# Vivado block design bd_8ee2, xc7z020clg400-1, Vivado 2019.1
# (continued, part 4 of 5)
current_bd_instance /s15_nodes

# ---- hierarchy /m00_nodes ----
current_bd_instance /m00_nodes
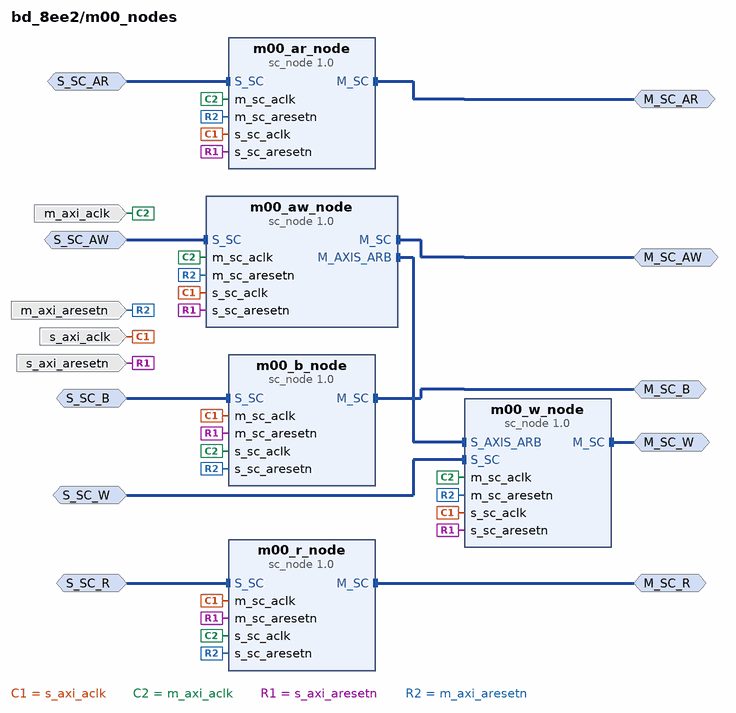
[diagram p35: block diagram inside /m00_nodes]
create_bd_intf_pin -mode Master -vlnv xilinx.com:interface:sc_rtl:1.0 M_SC_AR
create_bd_intf_pin -mode Slave -vlnv xilinx.com:interface:sc_rtl:1.0 S_SC_AR
create_bd_intf_pin -mode Master -vlnv xilinx.com:interface:sc_rtl:1.0 M_SC_R
create_bd_intf_pin -mode Slave -vlnv xilinx.com:interface:sc_rtl:1.0 S_SC_R
create_bd_intf_pin -mode Master -vlnv xilinx.com:interface:sc_rtl:1.0 M_SC_AW
create_bd_intf_pin -mode Slave -vlnv xilinx.com:interface:sc_rtl:1.0 S_SC_AW
create_bd_intf_pin -mode Master -vlnv xilinx.com:interface:sc_rtl:1.0 M_SC_W
create_bd_intf_pin -mode Slave -vlnv xilinx.com:interface:sc_rtl:1.0 S_SC_W
create_bd_intf_pin -mode Master -vlnv xilinx.com:interface:sc_rtl:1.0 M_SC_B
create_bd_intf_pin -mode Slave -vlnv xilinx.com:interface:sc_rtl:1.0 S_SC_B
create_bd_pin -dir I -type clk s_axi_aclk
create_bd_pin -dir I -type rst s_axi_aresetn
create_bd_pin -dir I -type clk m_axi_aclk
create_bd_pin -dir I -type rst m_axi_aresetn

create_bd_cell -type ip -vlnv xilinx.com:ip:sc_node:1.0 m00_ar_node
set_property -dict [list \
  CONFIG.ACLK_RELATIONSHIP 1 \
  CONFIG.ADDR_WIDTH 32 \
  CONFIG.CHANNEL 2 \
  CONFIG.ID_WIDTH 5 \
  CONFIG.M00_NUM_BYTES 8 \
  CONFIG.M01_NUM_BYTES 8 \
  CONFIG.M02_NUM_BYTES 8 \
  CONFIG.M03_NUM_BYTES 8 \
  CONFIG.M04_NUM_BYTES 8 \
  CONFIG.M05_NUM_BYTES 8 \
  CONFIG.M06_NUM_BYTES 8 \
  CONFIG.M07_NUM_BYTES 8 \
  CONFIG.M08_NUM_BYTES 8 \
  CONFIG.M09_NUM_BYTES 8 \
  CONFIG.M10_NUM_BYTES 8 \
  CONFIG.M11_NUM_BYTES 8 \
  CONFIG.M12_NUM_BYTES 8 \
  CONFIG.M13_NUM_BYTES 8 \
  CONFIG.M14_NUM_BYTES 8 \
  CONFIG.M15_NUM_BYTES 8 \
  CONFIG.MAX_PAYLD_BYTES 8 \
  CONFIG.M_SEND_PIPELINE 0 \
  CONFIG.NUM_MI 1 \
  CONFIG.NUM_OUTSTANDING 16 \
  CONFIG.NUM_SI 16 \
  CONFIG.PAYLD_WIDTH 146 \
  CONFIG.S00_NUM_BYTES 8 \
  CONFIG.S01_NUM_BYTES 8 \
  CONFIG.S02_NUM_BYTES 8 \
  CONFIG.S03_NUM_BYTES 8 \
  CONFIG.S04_NUM_BYTES 8 \
  CONFIG.S05_NUM_BYTES 8 \
  CONFIG.S06_NUM_BYTES 8 \
  CONFIG.S07_NUM_BYTES 8 \
  CONFIG.S08_NUM_BYTES 8 \
  CONFIG.S09_NUM_BYTES 8 \
  CONFIG.S10_NUM_BYTES 8 \
  CONFIG.S11_NUM_BYTES 8 \
  CONFIG.S12_NUM_BYTES 8 \
  CONFIG.S13_NUM_BYTES 8 \
  CONFIG.S14_NUM_BYTES 8 \
  CONFIG.S15_NUM_BYTES 8 \
  CONFIG.SC_ROUTE_WIDTH 1 \
  CONFIG.S_LATENCY 1 \
  CONFIG.USER_WIDTH 0 \
] [get_bd_cells m00_ar_node]
create_bd_cell -type ip -vlnv xilinx.com:ip:sc_node:1.0 m00_r_node
set_property -dict [list \
  CONFIG.ACLK_RELATIONSHIP 1 \
  CONFIG.ADDR_WIDTH 32 \
  CONFIG.CHANNEL 0 \
  CONFIG.ID_WIDTH 5 \
  CONFIG.M00_NUM_BYTES 8 \
  CONFIG.M01_NUM_BYTES 8 \
  CONFIG.M02_NUM_BYTES 8 \
  CONFIG.M03_NUM_BYTES 8 \
  CONFIG.M04_NUM_BYTES 8 \
  CONFIG.M05_NUM_BYTES 8 \
  CONFIG.M06_NUM_BYTES 8 \
  CONFIG.M07_NUM_BYTES 8 \
  CONFIG.M08_NUM_BYTES 8 \
  CONFIG.M09_NUM_BYTES 8 \
  CONFIG.M10_NUM_BYTES 8 \
  CONFIG.M11_NUM_BYTES 8 \
  CONFIG.M12_NUM_BYTES 8 \
  CONFIG.M13_NUM_BYTES 8 \
  CONFIG.M14_NUM_BYTES 8 \
  CONFIG.M15_NUM_BYTES 8 \
  CONFIG.MAX_PAYLD_BYTES 8 \
  CONFIG.M_PIPELINE 0 \
  CONFIG.NUM_MI 16 \
  CONFIG.NUM_OUTSTANDING 16 \
  CONFIG.NUM_SI 1 \
  CONFIG.PAYLD_WIDTH 102 \
  CONFIG.S00_NUM_BYTES 8 \
  CONFIG.S01_NUM_BYTES 8 \
  CONFIG.S02_NUM_BYTES 8 \
  CONFIG.S03_NUM_BYTES 8 \
  CONFIG.S04_NUM_BYTES 8 \
  CONFIG.S05_NUM_BYTES 8 \
  CONFIG.S06_NUM_BYTES 8 \
  CONFIG.S07_NUM_BYTES 8 \
  CONFIG.S08_NUM_BYTES 8 \
  CONFIG.S09_NUM_BYTES 8 \
  CONFIG.S10_NUM_BYTES 8 \
  CONFIG.S11_NUM_BYTES 8 \
  CONFIG.S12_NUM_BYTES 8 \
  CONFIG.S13_NUM_BYTES 8 \
  CONFIG.S14_NUM_BYTES 8 \
  CONFIG.S15_NUM_BYTES 8 \
  CONFIG.SC_ROUTE_WIDTH 16 \
  CONFIG.USER_BITS_PER_BYTE 0 \
  CONFIG.USER_WIDTH 0 \
] [get_bd_cells m00_r_node]
create_bd_cell -type ip -vlnv xilinx.com:ip:sc_node:1.0 m00_aw_node
set_property -dict [list \
  CONFIG.ACLK_RELATIONSHIP 1 \
  CONFIG.ADDR_WIDTH 32 \
  CONFIG.CHANNEL 3 \
  CONFIG.ID_WIDTH 5 \
  CONFIG.M00_NUM_BYTES 8 \
  CONFIG.M01_NUM_BYTES 8 \
  CONFIG.M02_NUM_BYTES 8 \
  CONFIG.M03_NUM_BYTES 8 \
  CONFIG.M04_NUM_BYTES 8 \
  CONFIG.M05_NUM_BYTES 8 \
  CONFIG.M06_NUM_BYTES 8 \
  CONFIG.M07_NUM_BYTES 8 \
  CONFIG.M08_NUM_BYTES 8 \
  CONFIG.M09_NUM_BYTES 8 \
  CONFIG.M10_NUM_BYTES 8 \
  CONFIG.M11_NUM_BYTES 8 \
  CONFIG.M12_NUM_BYTES 8 \
  CONFIG.M13_NUM_BYTES 8 \
  CONFIG.M14_NUM_BYTES 8 \
  CONFIG.M15_NUM_BYTES 8 \
  CONFIG.MAX_PAYLD_BYTES 8 \
  CONFIG.M_SEND_PIPELINE 0 \
  CONFIG.NUM_MI 1 \
  CONFIG.NUM_OUTSTANDING 16 \
  CONFIG.NUM_SI 16 \
  CONFIG.PAYLD_WIDTH 146 \
  CONFIG.S00_NUM_BYTES 8 \
  CONFIG.S01_NUM_BYTES 8 \
  CONFIG.S02_NUM_BYTES 8 \
  CONFIG.S03_NUM_BYTES 8 \
  CONFIG.S04_NUM_BYTES 8 \
  CONFIG.S05_NUM_BYTES 8 \
  CONFIG.S06_NUM_BYTES 8 \
  CONFIG.S07_NUM_BYTES 8 \
  CONFIG.S08_NUM_BYTES 8 \
  CONFIG.S09_NUM_BYTES 8 \
  CONFIG.S10_NUM_BYTES 8 \
  CONFIG.S11_NUM_BYTES 8 \
  CONFIG.S12_NUM_BYTES 8 \
  CONFIG.S13_NUM_BYTES 8 \
  CONFIG.S14_NUM_BYTES 8 \
  CONFIG.S15_NUM_BYTES 8 \
  CONFIG.SC_ROUTE_WIDTH 1 \
  CONFIG.S_LATENCY 1 \
  CONFIG.USER_WIDTH 0 \
] [get_bd_cells m00_aw_node]
create_bd_cell -type ip -vlnv xilinx.com:ip:sc_node:1.0 m00_w_node
set_property -dict [list \
  CONFIG.ACLK_RELATIONSHIP 1 \
  CONFIG.ADDR_WIDTH 32 \
  CONFIG.CHANNEL 1 \
  CONFIG.ID_WIDTH 5 \
  CONFIG.M00_NUM_BYTES 8 \
  CONFIG.M01_NUM_BYTES 8 \
  CONFIG.M02_NUM_BYTES 8 \
  CONFIG.M03_NUM_BYTES 8 \
  CONFIG.M04_NUM_BYTES 8 \
  CONFIG.M05_NUM_BYTES 8 \
  CONFIG.M06_NUM_BYTES 8 \
  CONFIG.M07_NUM_BYTES 8 \
  CONFIG.M08_NUM_BYTES 8 \
  CONFIG.M09_NUM_BYTES 8 \
  CONFIG.M10_NUM_BYTES 8 \
  CONFIG.M11_NUM_BYTES 8 \
  CONFIG.M12_NUM_BYTES 8 \
  CONFIG.M13_NUM_BYTES 8 \
  CONFIG.M14_NUM_BYTES 8 \
  CONFIG.M15_NUM_BYTES 8 \
  CONFIG.MAX_PAYLD_BYTES 8 \
  CONFIG.M_SEND_PIPELINE 0 \
  CONFIG.NUM_MI 1 \
  CONFIG.NUM_OUTSTANDING 16 \
  CONFIG.NUM_SI 16 \
  CONFIG.PAYLD_WIDTH 88 \
  CONFIG.S00_NUM_BYTES 8 \
  CONFIG.S01_NUM_BYTES 8 \
  CONFIG.S02_NUM_BYTES 8 \
  CONFIG.S03_NUM_BYTES 8 \
  CONFIG.S04_NUM_BYTES 8 \
  CONFIG.S05_NUM_BYTES 8 \
  CONFIG.S06_NUM_BYTES 8 \
  CONFIG.S07_NUM_BYTES 8 \
  CONFIG.S08_NUM_BYTES 8 \
  CONFIG.S09_NUM_BYTES 8 \
  CONFIG.S10_NUM_BYTES 8 \
  CONFIG.S11_NUM_BYTES 8 \
  CONFIG.S12_NUM_BYTES 8 \
  CONFIG.S13_NUM_BYTES 8 \
  CONFIG.S14_NUM_BYTES 8 \
  CONFIG.S15_NUM_BYTES 8 \
  CONFIG.SC_ROUTE_WIDTH 1 \
  CONFIG.S_LATENCY 1 \
  CONFIG.USER_BITS_PER_BYTE 0 \
  CONFIG.USER_WIDTH 0 \
] [get_bd_cells m00_w_node]
create_bd_cell -type ip -vlnv xilinx.com:ip:sc_node:1.0 m00_b_node
set_property -dict [list \
  CONFIG.ACLK_RELATIONSHIP 1 \
  CONFIG.ADDR_WIDTH 32 \
  CONFIG.CHANNEL 4 \
  CONFIG.ID_WIDTH 5 \
  CONFIG.M00_NUM_BYTES 8 \
  CONFIG.M01_NUM_BYTES 8 \
  CONFIG.M02_NUM_BYTES 8 \
  CONFIG.M03_NUM_BYTES 8 \
  CONFIG.M04_NUM_BYTES 8 \
  CONFIG.M05_NUM_BYTES 8 \
  CONFIG.M06_NUM_BYTES 8 \
  CONFIG.M07_NUM_BYTES 8 \
  CONFIG.M08_NUM_BYTES 8 \
  CONFIG.M09_NUM_BYTES 8 \
  CONFIG.M10_NUM_BYTES 8 \
  CONFIG.M11_NUM_BYTES 8 \
  CONFIG.M12_NUM_BYTES 8 \
  CONFIG.M13_NUM_BYTES 8 \
  CONFIG.M14_NUM_BYTES 8 \
  CONFIG.M15_NUM_BYTES 8 \
  CONFIG.MAX_PAYLD_BYTES 8 \
  CONFIG.M_PIPELINE 0 \
  CONFIG.NUM_MI 16 \
  CONFIG.NUM_OUTSTANDING 16 \
  CONFIG.NUM_SI 1 \
  CONFIG.PAYLD_WIDTH 24 \
  CONFIG.S00_NUM_BYTES 8 \
  CONFIG.S01_NUM_BYTES 8 \
  CONFIG.S02_NUM_BYTES 8 \
  CONFIG.S03_NUM_BYTES 8 \
  CONFIG.S04_NUM_BYTES 8 \
  CONFIG.S05_NUM_BYTES 8 \
  CONFIG.S06_NUM_BYTES 8 \
  CONFIG.S07_NUM_BYTES 8 \
  CONFIG.S08_NUM_BYTES 8 \
  CONFIG.S09_NUM_BYTES 8 \
  CONFIG.S10_NUM_BYTES 8 \
  CONFIG.S11_NUM_BYTES 8 \
  CONFIG.S12_NUM_BYTES 8 \
  CONFIG.S13_NUM_BYTES 8 \
  CONFIG.S14_NUM_BYTES 8 \
  CONFIG.S15_NUM_BYTES 8 \
  CONFIG.SC_ROUTE_WIDTH 16 \
  CONFIG.USER_WIDTH 0 \
] [get_bd_cells m00_b_node]

# ---- hierarchy /m00_exit_pipeline ----
current_bd_instance /m00_exit_pipeline
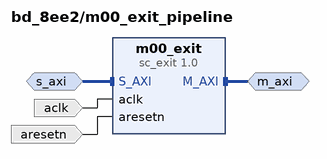
[diagram p36: block diagram inside /m00_exit_pipeline]
create_bd_intf_pin -mode Slave -vlnv xilinx.com:interface:aximm_rtl:1.0 s_axi
create_bd_intf_pin -mode Master -vlnv xilinx.com:interface:aximm_rtl:1.0 m_axi
create_bd_pin -dir I -type clk aclk
create_bd_pin -dir I -type rst aresetn

create_bd_cell -type ip -vlnv xilinx.com:ip:sc_exit:1.0 m00_exit
set_property -dict [list \
  CONFIG.ADDR_WIDTH 32 \
  CONFIG.HAS_BURST 1 \
  CONFIG.HAS_LOCK 0 \
  CONFIG.IS_CASCADED 0 \
  CONFIG.MAX_RUSER_BITS_PER_BYTE 0 \
  CONFIG.MAX_WUSER_BITS_PER_BYTE 0 \
  CONFIG.MEP_IDENTIFIER_WIDTH 5 \
  CONFIG.M_ARUSER_WIDTH 0 \
  CONFIG.M_AWUSER_WIDTH 0 \
  CONFIG.M_BUSER_WIDTH 0 \
  CONFIG.M_ID_WIDTH 0 \
  CONFIG.M_MAX_BURST_LENGTH 8 \
  CONFIG.M_PROTOCOL AXI3 \
  CONFIG.M_RUSER_BITS_PER_BYTE 0 \
  CONFIG.M_RUSER_WIDTH 0 \
  CONFIG.M_WUSER_BITS_PER_BYTE 0 \
  CONFIG.M_WUSER_WIDTH 0 \
  CONFIG.NUM_MSC 1 \
  CONFIG.NUM_READ_OUTSTANDING 16 \
  CONFIG.NUM_WRITE_OUTSTANDING 16 \
  CONFIG.RDATA_WIDTH 64 \
  CONFIG.READ_WRITE_MODE READ_WRITE \
  CONFIG.SSC000_ROUTE 0b0000000000000010 \
  CONFIG.SSC001_ROUTE 0b0000000000000001 \
  CONFIG.SSC002_ROUTE 0b0000000000000000 \
  CONFIG.SSC003_ROUTE 0b0000000000001000 \
  CONFIG.SSC004_ROUTE 0b0000000000000100 \
  CONFIG.SSC005_ROUTE 0b0000000000010000 \
  CONFIG.SSC006_ROUTE 0b0000000000000000 \
  CONFIG.SSC007_ROUTE 0b0000000000000000 \
  CONFIG.SSC008_ROUTE 0b0000000000100000 \
  CONFIG.SSC009_ROUTE 0b0000000010000000 \
  CONFIG.SSC010_ROUTE 0b0000000001000000 \
  CONFIG.SSC011_ROUTE 0b0000000000000000 \
  CONFIG.SSC012_ROUTE 0b0000000000000000 \
  CONFIG.SSC013_ROUTE 0b0000001000000000 \
  CONFIG.SSC014_ROUTE 0b0000000100000000 \
  CONFIG.SSC015_ROUTE 0b0000100000000000 \
  CONFIG.SSC016_ROUTE 0b0000010000000000 \
  CONFIG.SSC017_ROUTE 0b0010000000000000 \
  CONFIG.SSC018_ROUTE 0b0001000000000000 \
  CONFIG.SSC019_ROUTE 0b1000000000000000 \
  CONFIG.SSC020_ROUTE 0b0100000000000000 \
  CONFIG.SSC021_ROUTE 0b0000000000000000 \
  CONFIG.SSC022_ROUTE 0b0000000000000000 \
  CONFIG.SSC023_ROUTE 0b0000000000000000 \
  CONFIG.SSC024_ROUTE 0b0000000000000000 \
  CONFIG.SSC025_ROUTE 0b0000000000000000 \
  CONFIG.SSC026_ROUTE 0b0000000000000000 \
  CONFIG.SSC027_ROUTE 0b0000000000000000 \
  CONFIG.SSC028_ROUTE 0b0000000000000000 \
  CONFIG.SSC029_ROUTE 0b0000000000000000 \
  CONFIG.SSC030_ROUTE 0b0000000000000000 \
  CONFIG.SSC031_ROUTE 0b0000000000000000 \
  CONFIG.SSC_ROUTE_WIDTH 16 \
  CONFIG.S_ID_WIDTH 5 \
  CONFIG.WDATA_WIDTH 64 \
] [get_bd_cells m00_exit]

# ---- connections ----

current_bd_instance /clk_map
connect_bd_net -net clk_map_aresetn_net [get_bd_pins aresetn] [get_bd_pins psr_aclk/aux_reset_in]
connect_bd_net -net clk_map_aclk_net [get_bd_pins aclk] \
  [get_bd_pins S00_ACLK] [get_bd_pins S01_ACLK] [get_bd_pins S02_ACLK] [get_bd_pins S03_ACLK] [get_bd_pins S04_ACLK] \
  [get_bd_pins S05_ACLK] [get_bd_pins S06_ACLK] [get_bd_pins S07_ACLK] [get_bd_pins S08_ACLK] [get_bd_pins S09_ACLK] \
  [get_bd_pins S10_ACLK] [get_bd_pins S11_ACLK] [get_bd_pins S12_ACLK] [get_bd_pins S13_ACLK] [get_bd_pins S14_ACLK] \
  [get_bd_pins S15_ACLK] [get_bd_pins M00_ACLK] [get_bd_pins swbd_aclk] [get_bd_pins psr_aclk/slowest_sync_clk]
connect_bd_net [get_bd_pins psr_aclk/interconnect_aresetn] \
  [get_bd_pins S00_ARESETN] [get_bd_pins S01_ARESETN] [get_bd_pins S02_ARESETN] [get_bd_pins S03_ARESETN] \
  [get_bd_pins S04_ARESETN] [get_bd_pins S05_ARESETN] [get_bd_pins S06_ARESETN] [get_bd_pins S07_ARESETN] \
  [get_bd_pins S08_ARESETN] [get_bd_pins S09_ARESETN] [get_bd_pins S10_ARESETN] [get_bd_pins S11_ARESETN] \
  [get_bd_pins S12_ARESETN] [get_bd_pins S13_ARESETN] [get_bd_pins S14_ARESETN] [get_bd_pins S15_ARESETN] \
  [get_bd_pins M00_ARESETN] [get_bd_pins swbd_aresetn]
connect_bd_net [get_bd_pins one/dout] [get_bd_pins psr_aclk/ext_reset_in]

current_bd_instance /switchboards
connect_bd_intf_net [get_bd_intf_pins M08_SC_R] [get_bd_intf_pins r_switchboard/M08_SC]
connect_bd_intf_net [get_bd_intf_pins M04_SC_R] [get_bd_intf_pins r_switchboard/M04_SC]
connect_bd_intf_net [get_bd_intf_pins M05_SC_R] [get_bd_intf_pins r_switchboard/M05_SC]
connect_bd_intf_net [get_bd_intf_pins M06_SC_R] [get_bd_intf_pins r_switchboard/M06_SC]
connect_bd_intf_net [get_bd_intf_pins M07_SC_R] [get_bd_intf_pins r_switchboard/M07_SC]
connect_bd_intf_net [get_bd_intf_pins M12_SC_R] [get_bd_intf_pins r_switchboard/M12_SC]
connect_bd_intf_net [get_bd_intf_pins M10_SC_R] [get_bd_intf_pins r_switchboard/M10_SC]
connect_bd_intf_net [get_bd_intf_pins M09_SC_R] [get_bd_intf_pins r_switchboard/M09_SC]
connect_bd_intf_net [get_bd_intf_pins M13_SC_R] [get_bd_intf_pins r_switchboard/M13_SC]
connect_bd_intf_net [get_bd_intf_pins M11_SC_R] [get_bd_intf_pins r_switchboard/M11_SC]
connect_bd_intf_net [get_bd_intf_pins M14_SC_R] [get_bd_intf_pins r_switchboard/M14_SC]
connect_bd_intf_net [get_bd_intf_pins M15_SC_R] [get_bd_intf_pins r_switchboard/M15_SC]
connect_bd_intf_net [get_bd_intf_pins M02_SC_R] [get_bd_intf_pins r_switchboard/M02_SC]
connect_bd_intf_net [get_bd_intf_pins S00_SC_R] [get_bd_intf_pins r_switchboard/S00_SC]
connect_bd_intf_net [get_bd_intf_pins M00_SC_R] [get_bd_intf_pins r_switchboard/M00_SC]
connect_bd_intf_net [get_bd_intf_pins M01_SC_R] [get_bd_intf_pins r_switchboard/M01_SC]
connect_bd_intf_net [get_bd_intf_pins M03_SC_R] [get_bd_intf_pins r_switchboard/M03_SC]
connect_bd_intf_net [get_bd_intf_pins M02_SC_B] [get_bd_intf_pins b_switchboard/M02_SC]
connect_bd_intf_net [get_bd_intf_pins M00_SC_B] [get_bd_intf_pins b_switchboard/M00_SC]
connect_bd_intf_net [get_bd_intf_pins M01_SC_B] [get_bd_intf_pins b_switchboard/M01_SC]
connect_bd_intf_net [get_bd_intf_pins M03_SC_B] [get_bd_intf_pins b_switchboard/M03_SC]
connect_bd_intf_net [get_bd_intf_pins S00_SC_B] [get_bd_intf_pins b_switchboard/S00_SC]
connect_bd_intf_net [get_bd_intf_pins M08_SC_B] [get_bd_intf_pins b_switchboard/M08_SC]
connect_bd_intf_net [get_bd_intf_pins M06_SC_B] [get_bd_intf_pins b_switchboard/M06_SC]
connect_bd_intf_net [get_bd_intf_pins M05_SC_B] [get_bd_intf_pins b_switchboard/M05_SC]
connect_bd_intf_net [get_bd_intf_pins M07_SC_B] [get_bd_intf_pins b_switchboard/M07_SC]
connect_bd_intf_net [get_bd_intf_pins M04_SC_B] [get_bd_intf_pins b_switchboard/M04_SC]
connect_bd_intf_net [get_bd_intf_pins M12_SC_B] [get_bd_intf_pins b_switchboard/M12_SC]
connect_bd_intf_net [get_bd_intf_pins M11_SC_B] [get_bd_intf_pins b_switchboard/M11_SC]
connect_bd_intf_net [get_bd_intf_pins M10_SC_B] [get_bd_intf_pins b_switchboard/M10_SC]
connect_bd_intf_net [get_bd_intf_pins M09_SC_B] [get_bd_intf_pins b_switchboard/M09_SC]
connect_bd_intf_net [get_bd_intf_pins S00_SC_AR] [get_bd_intf_pins ar_switchboard/S00_SC]
connect_bd_intf_net [get_bd_intf_pins S01_SC_AR] [get_bd_intf_pins ar_switchboard/S01_SC]
connect_bd_intf_net [get_bd_intf_pins S02_SC_AR] [get_bd_intf_pins ar_switchboard/S02_SC]
connect_bd_intf_net [get_bd_intf_pins S01_SC_AW] [get_bd_intf_pins aw_switchboard/S01_SC]
connect_bd_intf_net [get_bd_intf_pins S00_SC_AW] [get_bd_intf_pins aw_switchboard/S00_SC]
connect_bd_intf_net [get_bd_intf_pins S04_SC_AW] [get_bd_intf_pins aw_switchboard/S04_SC]
connect_bd_intf_net [get_bd_intf_pins S02_SC_AW] [get_bd_intf_pins aw_switchboard/S02_SC]
connect_bd_intf_net [get_bd_intf_pins S03_SC_AW] [get_bd_intf_pins aw_switchboard/S03_SC]
connect_bd_intf_net [get_bd_intf_pins S06_SC_AW] [get_bd_intf_pins aw_switchboard/S06_SC]
connect_bd_intf_net [get_bd_intf_pins S08_SC_AW] [get_bd_intf_pins aw_switchboard/S08_SC]
connect_bd_intf_net [get_bd_intf_pins S09_SC_AW] [get_bd_intf_pins aw_switchboard/S09_SC]
connect_bd_intf_net [get_bd_intf_pins S07_SC_AW] [get_bd_intf_pins aw_switchboard/S07_SC]
connect_bd_intf_net [get_bd_intf_pins S05_SC_AW] [get_bd_intf_pins aw_switchboard/S05_SC]
connect_bd_intf_net [get_bd_intf_pins S10_SC_AW] [get_bd_intf_pins aw_switchboard/S10_SC]
connect_bd_intf_net [get_bd_intf_pins S13_SC_AW] [get_bd_intf_pins aw_switchboard/S13_SC]
connect_bd_intf_net [get_bd_intf_pins S11_SC_AW] [get_bd_intf_pins aw_switchboard/S11_SC]
connect_bd_intf_net [get_bd_intf_pins S12_SC_AW] [get_bd_intf_pins aw_switchboard/S12_SC]
connect_bd_intf_net [get_bd_intf_pins S14_SC_AW] [get_bd_intf_pins aw_switchboard/S14_SC]
connect_bd_intf_net [get_bd_intf_pins M00_SC_AW] [get_bd_intf_pins aw_switchboard/M00_SC]
connect_bd_intf_net [get_bd_intf_pins S15_SC_AW] [get_bd_intf_pins aw_switchboard/S15_SC]
connect_bd_intf_net [get_bd_intf_pins M14_SC_B] [get_bd_intf_pins b_switchboard/M14_SC]
connect_bd_intf_net [get_bd_intf_pins M13_SC_B] [get_bd_intf_pins b_switchboard/M13_SC]
connect_bd_intf_net [get_bd_intf_pins M15_SC_B] [get_bd_intf_pins b_switchboard/M15_SC]
connect_bd_intf_net [get_bd_intf_pins S00_SC_W] [get_bd_intf_pins w_switchboard/S00_SC]
connect_bd_intf_net [get_bd_intf_pins S01_SC_W] [get_bd_intf_pins w_switchboard/S01_SC]
connect_bd_intf_net [get_bd_intf_pins S02_SC_W] [get_bd_intf_pins w_switchboard/S02_SC]
connect_bd_intf_net [get_bd_intf_pins S04_SC_W] [get_bd_intf_pins w_switchboard/S04_SC]
connect_bd_intf_net [get_bd_intf_pins S03_SC_W] [get_bd_intf_pins w_switchboard/S03_SC]
connect_bd_intf_net [get_bd_intf_pins S06_SC_W] [get_bd_intf_pins w_switchboard/S06_SC]
connect_bd_intf_net [get_bd_intf_pins S05_SC_W] [get_bd_intf_pins w_switchboard/S05_SC]
connect_bd_intf_net [get_bd_intf_pins S10_SC_W] [get_bd_intf_pins w_switchboard/S10_SC]
connect_bd_intf_net [get_bd_intf_pins S07_SC_W] [get_bd_intf_pins w_switchboard/S07_SC]
connect_bd_intf_net [get_bd_intf_pins S11_SC_W] [get_bd_intf_pins w_switchboard/S11_SC]
connect_bd_intf_net [get_bd_intf_pins S08_SC_W] [get_bd_intf_pins w_switchboard/S08_SC]
connect_bd_intf_net [get_bd_intf_pins S09_SC_W] [get_bd_intf_pins w_switchboard/S09_SC]
connect_bd_intf_net [get_bd_intf_pins S13_SC_W] [get_bd_intf_pins w_switchboard/S13_SC]
connect_bd_intf_net [get_bd_intf_pins S15_SC_W] [get_bd_intf_pins w_switchboard/S15_SC]
connect_bd_intf_net [get_bd_intf_pins S14_SC_W] [get_bd_intf_pins w_switchboard/S14_SC]
connect_bd_intf_net [get_bd_intf_pins M00_SC_W] [get_bd_intf_pins w_switchboard/M00_SC]
connect_bd_intf_net [get_bd_intf_pins S12_SC_W] [get_bd_intf_pins w_switchboard/S12_SC]
connect_bd_intf_net [get_bd_intf_pins S06_SC_AR] [get_bd_intf_pins ar_switchboard/S06_SC]
connect_bd_intf_net [get_bd_intf_pins S03_SC_AR] [get_bd_intf_pins ar_switchboard/S03_SC]
connect_bd_intf_net [get_bd_intf_pins S05_SC_AR] [get_bd_intf_pins ar_switchboard/S05_SC]
connect_bd_intf_net [get_bd_intf_pins S04_SC_AR] [get_bd_intf_pins ar_switchboard/S04_SC]
connect_bd_intf_net [get_bd_intf_pins S07_SC_AR] [get_bd_intf_pins ar_switchboard/S07_SC]
connect_bd_intf_net [get_bd_intf_pins S08_SC_AR] [get_bd_intf_pins ar_switchboard/S08_SC]
connect_bd_intf_net [get_bd_intf_pins S10_SC_AR] [get_bd_intf_pins ar_switchboard/S10_SC]
connect_bd_intf_net [get_bd_intf_pins S09_SC_AR] [get_bd_intf_pins ar_switchboard/S09_SC]
connect_bd_intf_net [get_bd_intf_pins S13_SC_AR] [get_bd_intf_pins ar_switchboard/S13_SC]
connect_bd_intf_net [get_bd_intf_pins S12_SC_AR] [get_bd_intf_pins ar_switchboard/S12_SC]
connect_bd_intf_net [get_bd_intf_pins S11_SC_AR] [get_bd_intf_pins ar_switchboard/S11_SC]
connect_bd_intf_net [get_bd_intf_pins S14_SC_AR] [get_bd_intf_pins ar_switchboard/S14_SC]
connect_bd_intf_net [get_bd_intf_pins S15_SC_AR] [get_bd_intf_pins ar_switchboard/S15_SC]
connect_bd_intf_net [get_bd_intf_pins M00_SC_AR] [get_bd_intf_pins ar_switchboard/M00_SC]
connect_bd_net [get_bd_pins aclk] \
  [get_bd_pins ar_switchboard/aclk] [get_bd_pins aw_switchboard/aclk] [get_bd_pins b_switchboard/aclk] \
  [get_bd_pins r_switchboard/aclk] [get_bd_pins w_switchboard/aclk]

current_bd_instance /s00_entry_pipeline
connect_bd_intf_net [get_bd_intf_pins s00_mmu/M_AXI] [get_bd_intf_pins s00_transaction_regulator/S_AXI]
connect_bd_intf_net [get_bd_intf_pins s00_transaction_regulator/M_AXI] [get_bd_intf_pins s00_si_converter/S_AXI]
connect_bd_intf_net [get_bd_intf_pins s_axi] [get_bd_intf_pins s00_mmu/S_AXI]
connect_bd_intf_net [get_bd_intf_pins m_axi] [get_bd_intf_pins s00_si_converter/M_AXI]
connect_bd_net [get_bd_pins aclk] [get_bd_pins s00_mmu/aclk] [get_bd_pins s00_si_converter/aclk] [get_bd_pins s00_transaction_regulator/aclk]
connect_bd_net [get_bd_pins aresetn] \
  [get_bd_pins s00_mmu/aresetn] [get_bd_pins s00_si_converter/aresetn] [get_bd_pins s00_transaction_regulator/aresetn]

current_bd_instance /s00_nodes
connect_bd_intf_net [get_bd_intf_pins M_SC_AR] [get_bd_intf_pins s00_ar_node/M_SC]
connect_bd_intf_net [get_bd_intf_pins S_SC_AR] [get_bd_intf_pins s00_ar_node/S_SC]
connect_bd_intf_net [get_bd_intf_pins M_SC_R] [get_bd_intf_pins s00_r_node/M_SC]
connect_bd_intf_net [get_bd_intf_pins S_SC_R] [get_bd_intf_pins s00_r_node/S_SC]
connect_bd_net [get_bd_pins s_sc_clk] [get_bd_pins s00_ar_node/s_sc_aclk] [get_bd_pins s00_r_node/m_sc_aclk]
connect_bd_net [get_bd_pins m_sc_clk] [get_bd_pins s00_ar_node/m_sc_aclk] [get_bd_pins s00_r_node/s_sc_aclk]
connect_bd_net [get_bd_pins s_sc_resetn] [get_bd_pins s00_ar_node/s_sc_aresetn] [get_bd_pins s00_r_node/m_sc_aresetn]
connect_bd_net [get_bd_pins m_sc_resetn] [get_bd_pins s00_ar_node/m_sc_aresetn] [get_bd_pins s00_r_node/s_sc_aresetn]

current_bd_instance /s01_entry_pipeline
connect_bd_intf_net [get_bd_intf_pins s01_mmu/M_AXI] [get_bd_intf_pins s01_transaction_regulator/S_AXI]
connect_bd_intf_net [get_bd_intf_pins s_axi] [get_bd_intf_pins s01_mmu/S_AXI]
connect_bd_intf_net [get_bd_intf_pins s01_transaction_regulator/M_AXI] [get_bd_intf_pins s01_si_converter/S_AXI]
connect_bd_intf_net [get_bd_intf_pins m_axi] [get_bd_intf_pins s01_si_converter/M_AXI]
connect_bd_net [get_bd_pins aclk] [get_bd_pins s01_mmu/aclk] [get_bd_pins s01_si_converter/aclk] [get_bd_pins s01_transaction_regulator/aclk]
connect_bd_net [get_bd_pins aresetn] \
  [get_bd_pins s01_mmu/aresetn] [get_bd_pins s01_si_converter/aresetn] [get_bd_pins s01_transaction_regulator/aresetn]

current_bd_instance /s01_nodes
connect_bd_intf_net [get_bd_intf_pins M_SC_AR] [get_bd_intf_pins s01_ar_node/M_SC]
connect_bd_intf_net [get_bd_intf_pins S_SC_AR] [get_bd_intf_pins s01_ar_node/S_SC]
connect_bd_intf_net [get_bd_intf_pins S_SC_R] [get_bd_intf_pins s01_r_node/S_SC]
connect_bd_intf_net [get_bd_intf_pins M_SC_R] [get_bd_intf_pins s01_r_node/M_SC]
connect_bd_net [get_bd_pins s_sc_clk] [get_bd_pins s01_ar_node/s_sc_aclk] [get_bd_pins s01_r_node/m_sc_aclk]
connect_bd_net [get_bd_pins m_sc_clk] [get_bd_pins s01_ar_node/m_sc_aclk] [get_bd_pins s01_r_node/s_sc_aclk]
connect_bd_net [get_bd_pins s_sc_resetn] [get_bd_pins s01_ar_node/s_sc_aresetn] [get_bd_pins s01_r_node/m_sc_aresetn]
connect_bd_net [get_bd_pins m_sc_resetn] [get_bd_pins s01_ar_node/m_sc_aresetn] [get_bd_pins s01_r_node/s_sc_aresetn]

current_bd_instance /s02_entry_pipeline
connect_bd_intf_net [get_bd_intf_pins s02_mmu/M_AXI] [get_bd_intf_pins s02_transaction_regulator/S_AXI]
connect_bd_intf_net [get_bd_intf_pins m_axi] [get_bd_intf_pins s02_si_converter/M_AXI]
connect_bd_intf_net [get_bd_intf_pins s02_transaction_regulator/M_AXI] [get_bd_intf_pins s02_si_converter/S_AXI]
connect_bd_intf_net [get_bd_intf_pins s_axi] [get_bd_intf_pins s02_mmu/S_AXI]
connect_bd_net [get_bd_pins aclk] [get_bd_pins s02_mmu/aclk] [get_bd_pins s02_si_converter/aclk] [get_bd_pins s02_transaction_regulator/aclk]
connect_bd_net [get_bd_pins aresetn] \
  [get_bd_pins s02_mmu/aresetn] [get_bd_pins s02_si_converter/aresetn] [get_bd_pins s02_transaction_regulator/aresetn]

current_bd_instance /s02_nodes
connect_bd_intf_net [get_bd_intf_pins S_SC_AR] [get_bd_intf_pins s02_ar_node/S_SC]
connect_bd_intf_net [get_bd_intf_pins M_SC_AR] [get_bd_intf_pins s02_ar_node/M_SC]
connect_bd_intf_net [get_bd_intf_pins M_SC_R] [get_bd_intf_pins s02_r_node/M_SC]
connect_bd_intf_net [get_bd_intf_pins S_SC_R] [get_bd_intf_pins s02_r_node/S_SC]
connect_bd_net [get_bd_pins s_sc_clk] [get_bd_pins s02_ar_node/s_sc_aclk] [get_bd_pins s02_r_node/m_sc_aclk]
connect_bd_net [get_bd_pins m_sc_clk] [get_bd_pins s02_ar_node/m_sc_aclk] [get_bd_pins s02_r_node/s_sc_aclk]
connect_bd_net [get_bd_pins s_sc_resetn] [get_bd_pins s02_ar_node/s_sc_aresetn] [get_bd_pins s02_r_node/m_sc_aresetn]
connect_bd_net [get_bd_pins m_sc_resetn] [get_bd_pins s02_ar_node/m_sc_aresetn] [get_bd_pins s02_r_node/s_sc_aresetn]

current_bd_instance /s03_entry_pipeline
connect_bd_intf_net [get_bd_intf_pins s03_mmu/M_AXI] [get_bd_intf_pins s03_transaction_regulator/S_AXI]
connect_bd_intf_net [get_bd_intf_pins s03_transaction_regulator/M_AXI] [get_bd_intf_pins s03_si_converter/S_AXI]
connect_bd_intf_net [get_bd_intf_pins s_axi] [get_bd_intf_pins s03_mmu/S_AXI]
connect_bd_intf_net [get_bd_intf_pins m_axi] [get_bd_intf_pins s03_si_converter/M_AXI]
connect_bd_net [get_bd_pins aclk] [get_bd_pins s03_mmu/aclk] [get_bd_pins s03_si_converter/aclk] [get_bd_pins s03_transaction_regulator/aclk]
connect_bd_net [get_bd_pins aresetn] \
  [get_bd_pins s03_mmu/aresetn] [get_bd_pins s03_si_converter/aresetn] [get_bd_pins s03_transaction_regulator/aresetn]

current_bd_instance /s03_nodes
connect_bd_intf_net [get_bd_intf_pins S_SC_AW] [get_bd_intf_pins s03_aw_node/S_SC]
connect_bd_intf_net [get_bd_intf_pins M_SC_AW] [get_bd_intf_pins s03_aw_node/M_SC]
connect_bd_intf_net [get_bd_intf_pins M_SC_B] [get_bd_intf_pins s03_b_node/M_SC]
connect_bd_intf_net [get_bd_intf_pins S_SC_B] [get_bd_intf_pins s03_b_node/S_SC]
connect_bd_intf_net [get_bd_intf_pins S_SC_W] [get_bd_intf_pins s03_w_node/S_SC]
connect_bd_intf_net [get_bd_intf_pins M_SC_W] [get_bd_intf_pins s03_w_node/M_SC]
connect_bd_net [get_bd_pins s_sc_clk] [get_bd_pins s03_aw_node/s_sc_aclk] [get_bd_pins s03_w_node/s_sc_aclk] [get_bd_pins s03_b_node/m_sc_aclk]
connect_bd_net [get_bd_pins m_sc_clk] [get_bd_pins s03_aw_node/m_sc_aclk] [get_bd_pins s03_w_node/m_sc_aclk] [get_bd_pins s03_b_node/s_sc_aclk]
connect_bd_net [get_bd_pins s_sc_resetn] \
  [get_bd_pins s03_aw_node/s_sc_aresetn] [get_bd_pins s03_w_node/s_sc_aresetn] [get_bd_pins s03_b_node/m_sc_aresetn]
connect_bd_net [get_bd_pins m_sc_resetn] \
  [get_bd_pins s03_aw_node/m_sc_aresetn] [get_bd_pins s03_w_node/m_sc_aresetn] [get_bd_pins s03_b_node/s_sc_aresetn]

current_bd_instance /s04_entry_pipeline
connect_bd_intf_net [get_bd_intf_pins s04_mmu/M_AXI] [get_bd_intf_pins s04_transaction_regulator/S_AXI]
connect_bd_intf_net [get_bd_intf_pins s04_transaction_regulator/M_AXI] [get_bd_intf_pins s04_si_converter/S_AXI]
connect_bd_intf_net [get_bd_intf_pins s_axi] [get_bd_intf_pins s04_mmu/S_AXI]
connect_bd_intf_net [get_bd_intf_pins m_axi] [get_bd_intf_pins s04_si_converter/M_AXI]
connect_bd_net [get_bd_pins aclk] [get_bd_pins s04_mmu/aclk] [get_bd_pins s04_si_converter/aclk] [get_bd_pins s04_transaction_regulator/aclk]
connect_bd_net [get_bd_pins aresetn] \
  [get_bd_pins s04_mmu/aresetn] [get_bd_pins s04_si_converter/aresetn] [get_bd_pins s04_transaction_regulator/aresetn]

current_bd_instance /s04_nodes
connect_bd_intf_net [get_bd_intf_pins M_SC_AR] [get_bd_intf_pins s04_ar_node/M_SC]
connect_bd_intf_net [get_bd_intf_pins S_SC_AR] [get_bd_intf_pins s04_ar_node/S_SC]
connect_bd_intf_net [get_bd_intf_pins M_SC_R] [get_bd_intf_pins s04_r_node/M_SC]
connect_bd_intf_net [get_bd_intf_pins S_SC_R] [get_bd_intf_pins s04_r_node/S_SC]
connect_bd_net [get_bd_pins s_sc_clk] [get_bd_pins s04_ar_node/s_sc_aclk] [get_bd_pins s04_r_node/m_sc_aclk]
connect_bd_net [get_bd_pins m_sc_clk] [get_bd_pins s04_ar_node/m_sc_aclk] [get_bd_pins s04_r_node/s_sc_aclk]
connect_bd_net [get_bd_pins s_sc_resetn] [get_bd_pins s04_ar_node/s_sc_aresetn] [get_bd_pins s04_r_node/m_sc_aresetn]
connect_bd_net [get_bd_pins m_sc_resetn] [get_bd_pins s04_ar_node/m_sc_aresetn] [get_bd_pins s04_r_node/s_sc_aresetn]

current_bd_instance /s05_entry_pipeline
connect_bd_intf_net [get_bd_intf_pins s_axi] [get_bd_intf_pins s05_mmu/S_AXI]
connect_bd_intf_net [get_bd_intf_pins s05_transaction_regulator/M_AXI] [get_bd_intf_pins s05_si_converter/S_AXI]
connect_bd_intf_net [get_bd_intf_pins m_axi] [get_bd_intf_pins s05_si_converter/M_AXI]
connect_bd_intf_net [get_bd_intf_pins s05_mmu/M_AXI] [get_bd_intf_pins s05_transaction_regulator/S_AXI]
connect_bd_net [get_bd_pins aclk] [get_bd_pins s05_mmu/aclk] [get_bd_pins s05_si_converter/aclk] [get_bd_pins s05_transaction_regulator/aclk]
connect_bd_net [get_bd_pins aresetn] \
  [get_bd_pins s05_mmu/aresetn] [get_bd_pins s05_si_converter/aresetn] [get_bd_pins s05_transaction_regulator/aresetn]

current_bd_instance /s05_nodes
connect_bd_intf_net [get_bd_intf_pins S_SC_AR] [get_bd_intf_pins s05_ar_node/S_SC]
connect_bd_intf_net [get_bd_intf_pins M_SC_AR] [get_bd_intf_pins s05_ar_node/M_SC]
connect_bd_intf_net [get_bd_intf_pins S_SC_R] [get_bd_intf_pins s05_r_node/S_SC]
connect_bd_intf_net [get_bd_intf_pins M_SC_R] [get_bd_intf_pins s05_r_node/M_SC]
connect_bd_net [get_bd_pins s_sc_clk] [get_bd_pins s05_ar_node/s_sc_aclk] [get_bd_pins s05_r_node/m_sc_aclk]
connect_bd_net [get_bd_pins m_sc_clk] [get_bd_pins s05_ar_node/m_sc_aclk] [get_bd_pins s05_r_node/s_sc_aclk]
connect_bd_net [get_bd_pins s_sc_resetn] [get_bd_pins s05_ar_node/s_sc_aresetn] [get_bd_pins s05_r_node/m_sc_aresetn]
connect_bd_net [get_bd_pins m_sc_resetn] [get_bd_pins s05_ar_node/m_sc_aresetn] [get_bd_pins s05_r_node/s_sc_aresetn]

current_bd_instance /s06_entry_pipeline
connect_bd_intf_net [get_bd_intf_pins s06_transaction_regulator/M_AXI] [get_bd_intf_pins s06_si_converter/S_AXI]
connect_bd_intf_net [get_bd_intf_pins s_axi] [get_bd_intf_pins s06_mmu/S_AXI]
connect_bd_intf_net [get_bd_intf_pins m_axi] [get_bd_intf_pins s06_si_converter/M_AXI]
connect_bd_intf_net [get_bd_intf_pins s06_mmu/M_AXI] [get_bd_intf_pins s06_transaction_regulator/S_AXI]
connect_bd_net [get_bd_pins aclk] [get_bd_pins s06_mmu/aclk] [get_bd_pins s06_si_converter/aclk] [get_bd_pins s06_transaction_regulator/aclk]
connect_bd_net [get_bd_pins aresetn] \
  [get_bd_pins s06_mmu/aresetn] [get_bd_pins s06_si_converter/aresetn] [get_bd_pins s06_transaction_regulator/aresetn]

current_bd_instance /s06_nodes
connect_bd_intf_net [get_bd_intf_pins M_SC_AR] [get_bd_intf_pins s06_ar_node/M_SC]
connect_bd_intf_net [get_bd_intf_pins S_SC_AR] [get_bd_intf_pins s06_ar_node/S_SC]
connect_bd_intf_net [get_bd_intf_pins S_SC_R] [get_bd_intf_pins s06_r_node/S_SC]
connect_bd_intf_net [get_bd_intf_pins M_SC_R] [get_bd_intf_pins s06_r_node/M_SC]
connect_bd_net [get_bd_pins s_sc_clk] [get_bd_pins s06_ar_node/s_sc_aclk] [get_bd_pins s06_r_node/m_sc_aclk]
connect_bd_net [get_bd_pins m_sc_clk] [get_bd_pins s06_ar_node/m_sc_aclk] [get_bd_pins s06_r_node/s_sc_aclk]
connect_bd_net [get_bd_pins s_sc_resetn] [get_bd_pins s06_ar_node/s_sc_aresetn] [get_bd_pins s06_r_node/m_sc_aresetn]
connect_bd_net [get_bd_pins m_sc_resetn] [get_bd_pins s06_ar_node/m_sc_aresetn] [get_bd_pins s06_r_node/s_sc_aresetn]

current_bd_instance /s07_entry_pipeline
connect_bd_intf_net [get_bd_intf_pins s_axi] [get_bd_intf_pins s07_mmu/S_AXI]
connect_bd_intf_net [get_bd_intf_pins s07_transaction_regulator/M_AXI] [get_bd_intf_pins s07_si_converter/S_AXI]
connect_bd_intf_net [get_bd_intf_pins m_axi] [get_bd_intf_pins s07_si_converter/M_AXI]
connect_bd_intf_net [get_bd_intf_pins s07_mmu/M_AXI] [get_bd_intf_pins s07_transaction_regulator/S_AXI]
connect_bd_net [get_bd_pins aclk] [get_bd_pins s07_mmu/aclk] [get_bd_pins s07_si_converter/aclk] [get_bd_pins s07_transaction_regulator/aclk]
connect_bd_net [get_bd_pins aresetn] \
  [get_bd_pins s07_mmu/aresetn] [get_bd_pins s07_si_converter/aresetn] [get_bd_pins s07_transaction_regulator/aresetn]

current_bd_instance /s07_nodes
connect_bd_intf_net [get_bd_intf_pins M_SC_AW] [get_bd_intf_pins s07_aw_node/M_SC]
connect_bd_intf_net [get_bd_intf_pins S_SC_AW] [get_bd_intf_pins s07_aw_node/S_SC]
connect_bd_intf_net [get_bd_intf_pins M_SC_W] [get_bd_intf_pins s07_w_node/M_SC]
connect_bd_intf_net [get_bd_intf_pins S_SC_W] [get_bd_intf_pins s07_w_node/S_SC]
connect_bd_intf_net [get_bd_intf_pins S_SC_B] [get_bd_intf_pins s07_b_node/S_SC]
connect_bd_intf_net [get_bd_intf_pins M_SC_B] [get_bd_intf_pins s07_b_node/M_SC]
connect_bd_net [get_bd_pins s_sc_clk] [get_bd_pins s07_aw_node/s_sc_aclk] [get_bd_pins s07_w_node/s_sc_aclk] [get_bd_pins s07_b_node/m_sc_aclk]
connect_bd_net [get_bd_pins m_sc_clk] [get_bd_pins s07_aw_node/m_sc_aclk] [get_bd_pins s07_w_node/m_sc_aclk] [get_bd_pins s07_b_node/s_sc_aclk]
connect_bd_net [get_bd_pins s_sc_resetn] \
  [get_bd_pins s07_aw_node/s_sc_aresetn] [get_bd_pins s07_w_node/s_sc_aresetn] [get_bd_pins s07_b_node/m_sc_aresetn]
connect_bd_net [get_bd_pins m_sc_resetn] \
  [get_bd_pins s07_aw_node/m_sc_aresetn] [get_bd_pins s07_w_node/m_sc_aresetn] [get_bd_pins s07_b_node/s_sc_aresetn]

current_bd_instance /s08_entry_pipeline
connect_bd_intf_net [get_bd_intf_pins s08_mmu/M_AXI] [get_bd_intf_pins s08_transaction_regulator/S_AXI]
connect_bd_intf_net [get_bd_intf_pins s_axi] [get_bd_intf_pins s08_mmu/S_AXI]
connect_bd_intf_net [get_bd_intf_pins s08_transaction_regulator/M_AXI] [get_bd_intf_pins s08_si_converter/S_AXI]
connect_bd_intf_net [get_bd_intf_pins m_axi] [get_bd_intf_pins s08_si_converter/M_AXI]
connect_bd_net [get_bd_pins aclk] [get_bd_pins s08_mmu/aclk] [get_bd_pins s08_si_converter/aclk] [get_bd_pins s08_transaction_regulator/aclk]
connect_bd_net [get_bd_pins aresetn] \
  [get_bd_pins s08_mmu/aresetn] [get_bd_pins s08_si_converter/aresetn] [get_bd_pins s08_transaction_regulator/aresetn]

current_bd_instance /s08_nodes
connect_bd_intf_net [get_bd_intf_pins M_SC_AR] [get_bd_intf_pins s08_ar_node/M_SC]
connect_bd_intf_net [get_bd_intf_pins S_SC_AR] [get_bd_intf_pins s08_ar_node/S_SC]
connect_bd_intf_net [get_bd_intf_pins M_SC_R] [get_bd_intf_pins s08_r_node/M_SC]
connect_bd_intf_net [get_bd_intf_pins S_SC_R] [get_bd_intf_pins s08_r_node/S_SC]
connect_bd_net [get_bd_pins s_sc_clk] [get_bd_pins s08_ar_node/s_sc_aclk] [get_bd_pins s08_r_node/m_sc_aclk]
connect_bd_net [get_bd_pins m_sc_clk] [get_bd_pins s08_ar_node/m_sc_aclk] [get_bd_pins s08_r_node/s_sc_aclk]
connect_bd_net [get_bd_pins s_sc_resetn] [get_bd_pins s08_ar_node/s_sc_aresetn] [get_bd_pins s08_r_node/m_sc_aresetn]
connect_bd_net [get_bd_pins m_sc_resetn] [get_bd_pins s08_ar_node/m_sc_aresetn] [get_bd_pins s08_r_node/s_sc_aresetn]

current_bd_instance /s09_entry_pipeline
connect_bd_intf_net [get_bd_intf_pins s09_transaction_regulator/M_AXI] [get_bd_intf_pins s09_si_converter/S_AXI]
connect_bd_intf_net [get_bd_intf_pins s_axi] [get_bd_intf_pins s09_mmu/S_AXI]
connect_bd_intf_net [get_bd_intf_pins m_axi] [get_bd_intf_pins s09_si_converter/M_AXI]
connect_bd_intf_net [get_bd_intf_pins s09_mmu/M_AXI] [get_bd_intf_pins s09_transaction_regulator/S_AXI]
connect_bd_net [get_bd_pins aclk] [get_bd_pins s09_mmu/aclk] [get_bd_pins s09_si_converter/aclk] [get_bd_pins s09_transaction_regulator/aclk]
connect_bd_net [get_bd_pins aresetn] \
  [get_bd_pins s09_mmu/aresetn] [get_bd_pins s09_si_converter/aresetn] [get_bd_pins s09_transaction_regulator/aresetn]

current_bd_instance /s09_nodes
connect_bd_intf_net [get_bd_intf_pins S_SC_AR] [get_bd_intf_pins s09_ar_node/S_SC]
connect_bd_intf_net [get_bd_intf_pins M_SC_R] [get_bd_intf_pins s09_r_node/M_SC]
connect_bd_intf_net [get_bd_intf_pins S_SC_R] [get_bd_intf_pins s09_r_node/S_SC]
connect_bd_intf_net [get_bd_intf_pins M_SC_AR] [get_bd_intf_pins s09_ar_node/M_SC]
connect_bd_net [get_bd_pins s_sc_clk] [get_bd_pins s09_ar_node/s_sc_aclk] [get_bd_pins s09_r_node/m_sc_aclk]
connect_bd_net [get_bd_pins m_sc_clk] [get_bd_pins s09_ar_node/m_sc_aclk] [get_bd_pins s09_r_node/s_sc_aclk]
connect_bd_net [get_bd_pins s_sc_resetn] [get_bd_pins s09_ar_node/s_sc_aresetn] [get_bd_pins s09_r_node/m_sc_aresetn]
connect_bd_net [get_bd_pins m_sc_resetn] [get_bd_pins s09_ar_node/m_sc_aresetn] [get_bd_pins s09_r_node/s_sc_aresetn]

current_bd_instance /s10_entry_pipeline
connect_bd_intf_net [get_bd_intf_pins s_axi] [get_bd_intf_pins s10_mmu/S_AXI]
connect_bd_intf_net [get_bd_intf_pins s10_transaction_regulator/M_AXI] [get_bd_intf_pins s10_si_converter/S_AXI]
connect_bd_intf_net [get_bd_intf_pins m_axi] [get_bd_intf_pins s10_si_converter/M_AXI]
connect_bd_intf_net [get_bd_intf_pins s10_mmu/M_AXI] [get_bd_intf_pins s10_transaction_regulator/S_AXI]
connect_bd_net [get_bd_pins aclk] [get_bd_pins s10_mmu/aclk] [get_bd_pins s10_si_converter/aclk] [get_bd_pins s10_transaction_regulator/aclk]
connect_bd_net [get_bd_pins aresetn] \
  [get_bd_pins s10_mmu/aresetn] [get_bd_pins s10_si_converter/aresetn] [get_bd_pins s10_transaction_regulator/aresetn]

current_bd_instance /s10_nodes
connect_bd_intf_net [get_bd_intf_pins S_SC_AR] [get_bd_intf_pins s10_ar_node/S_SC]
connect_bd_intf_net [get_bd_intf_pins M_SC_AR] [get_bd_intf_pins s10_ar_node/M_SC]
connect_bd_intf_net [get_bd_intf_pins S_SC_R] [get_bd_intf_pins s10_r_node/S_SC]
connect_bd_intf_net [get_bd_intf_pins M_SC_R] [get_bd_intf_pins s10_r_node/M_SC]
connect_bd_net [get_bd_pins s_sc_clk] [get_bd_pins s10_ar_node/s_sc_aclk] [get_bd_pins s10_r_node/m_sc_aclk]
connect_bd_net [get_bd_pins m_sc_clk] [get_bd_pins s10_ar_node/m_sc_aclk] [get_bd_pins s10_r_node/s_sc_aclk]
connect_bd_net [get_bd_pins s_sc_resetn] [get_bd_pins s10_ar_node/s_sc_aresetn] [get_bd_pins s10_r_node/m_sc_aresetn]
connect_bd_net [get_bd_pins m_sc_resetn] [get_bd_pins s10_ar_node/m_sc_aresetn] [get_bd_pins s10_r_node/s_sc_aresetn]

current_bd_instance /s11_entry_pipeline
connect_bd_intf_net [get_bd_intf_pins s_axi] [get_bd_intf_pins s11_mmu/S_AXI]
connect_bd_intf_net [get_bd_intf_pins s11_transaction_regulator/M_AXI] [get_bd_intf_pins s11_si_converter/S_AXI]
connect_bd_intf_net [get_bd_intf_pins m_axi] [get_bd_intf_pins s11_si_converter/M_AXI]
connect_bd_intf_net [get_bd_intf_pins s11_mmu/M_AXI] [get_bd_intf_pins s11_transaction_regulator/S_AXI]
connect_bd_net [get_bd_pins aclk] [get_bd_pins s11_mmu/aclk] [get_bd_pins s11_si_converter/aclk] [get_bd_pins s11_transaction_regulator/aclk]
connect_bd_net [get_bd_pins aresetn] \
  [get_bd_pins s11_mmu/aresetn] [get_bd_pins s11_si_converter/aresetn] [get_bd_pins s11_transaction_regulator/aresetn]

current_bd_instance /s11_nodes
connect_bd_intf_net [get_bd_intf_pins M_SC_AW] [get_bd_intf_pins s11_aw_node/M_SC]
connect_bd_intf_net [get_bd_intf_pins S_SC_AW] [get_bd_intf_pins s11_aw_node/S_SC]
connect_bd_intf_net [get_bd_intf_pins M_SC_B] [get_bd_intf_pins s11_b_node/M_SC]
connect_bd_intf_net [get_bd_intf_pins S_SC_B] [get_bd_intf_pins s11_b_node/S_SC]
connect_bd_intf_net [get_bd_intf_pins M_SC_W] [get_bd_intf_pins s11_w_node/M_SC]
connect_bd_intf_net [get_bd_intf_pins S_SC_W] [get_bd_intf_pins s11_w_node/S_SC]
connect_bd_net [get_bd_pins s_sc_clk] [get_bd_pins s11_aw_node/s_sc_aclk] [get_bd_pins s11_w_node/s_sc_aclk] [get_bd_pins s11_b_node/m_sc_aclk]
connect_bd_net [get_bd_pins m_sc_clk] [get_bd_pins s11_aw_node/m_sc_aclk] [get_bd_pins s11_w_node/m_sc_aclk] [get_bd_pins s11_b_node/s_sc_aclk]
connect_bd_net [get_bd_pins s_sc_resetn] \
  [get_bd_pins s11_aw_node/s_sc_aresetn] [get_bd_pins s11_w_node/s_sc_aresetn] [get_bd_pins s11_b_node/m_sc_aresetn]
connect_bd_net [get_bd_pins m_sc_resetn] \
  [get_bd_pins s11_aw_node/m_sc_aresetn] [get_bd_pins s11_w_node/m_sc_aresetn] [get_bd_pins s11_b_node/s_sc_aresetn]

current_bd_instance /s12_entry_pipeline
connect_bd_intf_net [get_bd_intf_pins s12_transaction_regulator/M_AXI] [get_bd_intf_pins s12_si_converter/S_AXI]
connect_bd_intf_net [get_bd_intf_pins s_axi] [get_bd_intf_pins s12_mmu/S_AXI]
connect_bd_intf_net [get_bd_intf_pins s12_mmu/M_AXI] [get_bd_intf_pins s12_transaction_regulator/S_AXI]
connect_bd_intf_net [get_bd_intf_pins m_axi] [get_bd_intf_pins s12_si_converter/M_AXI]
connect_bd_net [get_bd_pins aclk] [get_bd_pins s12_mmu/aclk] [get_bd_pins s12_si_converter/aclk] [get_bd_pins s12_transaction_regulator/aclk]
connect_bd_net [get_bd_pins aresetn] \
  [get_bd_pins s12_mmu/aresetn] [get_bd_pins s12_si_converter/aresetn] [get_bd_pins s12_transaction_regulator/aresetn]

current_bd_instance /s12_nodes
connect_bd_intf_net [get_bd_intf_pins M_SC_R] [get_bd_intf_pins s12_r_node/M_SC]
connect_bd_intf_net [get_bd_intf_pins S_SC_R] [get_bd_intf_pins s12_r_node/S_SC]
connect_bd_intf_net [get_bd_intf_pins M_SC_AR] [get_bd_intf_pins s12_ar_node/M_SC]
connect_bd_intf_net [get_bd_intf_pins S_SC_AR] [get_bd_intf_pins s12_ar_node/S_SC]
connect_bd_net [get_bd_pins s_sc_clk] [get_bd_pins s12_ar_node/s_sc_aclk] [get_bd_pins s12_r_node/m_sc_aclk]
connect_bd_net [get_bd_pins m_sc_clk] [get_bd_pins s12_ar_node/m_sc_aclk] [get_bd_pins s12_r_node/s_sc_aclk]
connect_bd_net [get_bd_pins s_sc_resetn] [get_bd_pins s12_ar_node/s_sc_aresetn] [get_bd_pins s12_r_node/m_sc_aresetn]
connect_bd_net [get_bd_pins m_sc_resetn] [get_bd_pins s12_ar_node/m_sc_aresetn] [get_bd_pins s12_r_node/s_sc_aresetn]

current_bd_instance /s13_entry_pipeline
connect_bd_intf_net [get_bd_intf_pins s13_mmu/M_AXI] [get_bd_intf_pins s13_transaction_regulator/S_AXI]
connect_bd_intf_net [get_bd_intf_pins s13_transaction_regulator/M_AXI] [get_bd_intf_pins s13_si_converter/S_AXI]
connect_bd_intf_net [get_bd_intf_pins s_axi] [get_bd_intf_pins s13_mmu/S_AXI]
connect_bd_intf_net [get_bd_intf_pins m_axi] [get_bd_intf_pins s13_si_converter/M_AXI]
connect_bd_net [get_bd_pins aclk] [get_bd_pins s13_mmu/aclk] [get_bd_pins s13_si_converter/aclk] [get_bd_pins s13_transaction_regulator/aclk]
connect_bd_net [get_bd_pins aresetn] \
  [get_bd_pins s13_mmu/aresetn] [get_bd_pins s13_si_converter/aresetn] [get_bd_pins s13_transaction_regulator/aresetn]

current_bd_instance /s13_nodes
connect_bd_intf_net [get_bd_intf_pins M_SC_R] [get_bd_intf_pins s13_r_node/M_SC]
connect_bd_intf_net [get_bd_intf_pins S_SC_R] [get_bd_intf_pins s13_r_node/S_SC]
connect_bd_intf_net [get_bd_intf_pins S_SC_AR] [get_bd_intf_pins s13_ar_node/S_SC]
connect_bd_intf_net [get_bd_intf_pins M_SC_AR] [get_bd_intf_pins s13_ar_node/M_SC]
connect_bd_net [get_bd_pins s_sc_clk] [get_bd_pins s13_ar_node/s_sc_aclk] [get_bd_pins s13_r_node/m_sc_aclk]
connect_bd_net [get_bd_pins m_sc_clk] [get_bd_pins s13_ar_node/m_sc_aclk] [get_bd_pins s13_r_node/s_sc_aclk]
connect_bd_net [get_bd_pins s_sc_resetn] [get_bd_pins s13_ar_node/s_sc_aresetn] [get_bd_pins s13_r_node/m_sc_aresetn]
connect_bd_net [get_bd_pins m_sc_resetn] [get_bd_pins s13_ar_node/m_sc_aresetn] [get_bd_pins s13_r_node/s_sc_aresetn]

current_bd_instance /s14_entry_pipeline
connect_bd_intf_net [get_bd_intf_pins s_axi] [get_bd_intf_pins s14_mmu/S_AXI]
connect_bd_intf_net [get_bd_intf_pins s14_transaction_regulator/M_AXI] [get_bd_intf_pins s14_si_converter/S_AXI]
connect_bd_intf_net [get_bd_intf_pins m_axi] [get_bd_intf_pins s14_si_converter/M_AXI]
connect_bd_intf_net [get_bd_intf_pins s14_mmu/M_AXI] [get_bd_intf_pins s14_transaction_regulator/S_AXI]
connect_bd_net [get_bd_pins aclk] [get_bd_pins s14_mmu/aclk] [get_bd_pins s14_si_converter/aclk] [get_bd_pins s14_transaction_regulator/aclk]
connect_bd_net [get_bd_pins aresetn] \
  [get_bd_pins s14_mmu/aresetn] [get_bd_pins s14_si_converter/aresetn] [get_bd_pins s14_transaction_regulator/aresetn]
